# Altium schematic sheet Safety_2019_V_3_0_uController.SchDoc
size A
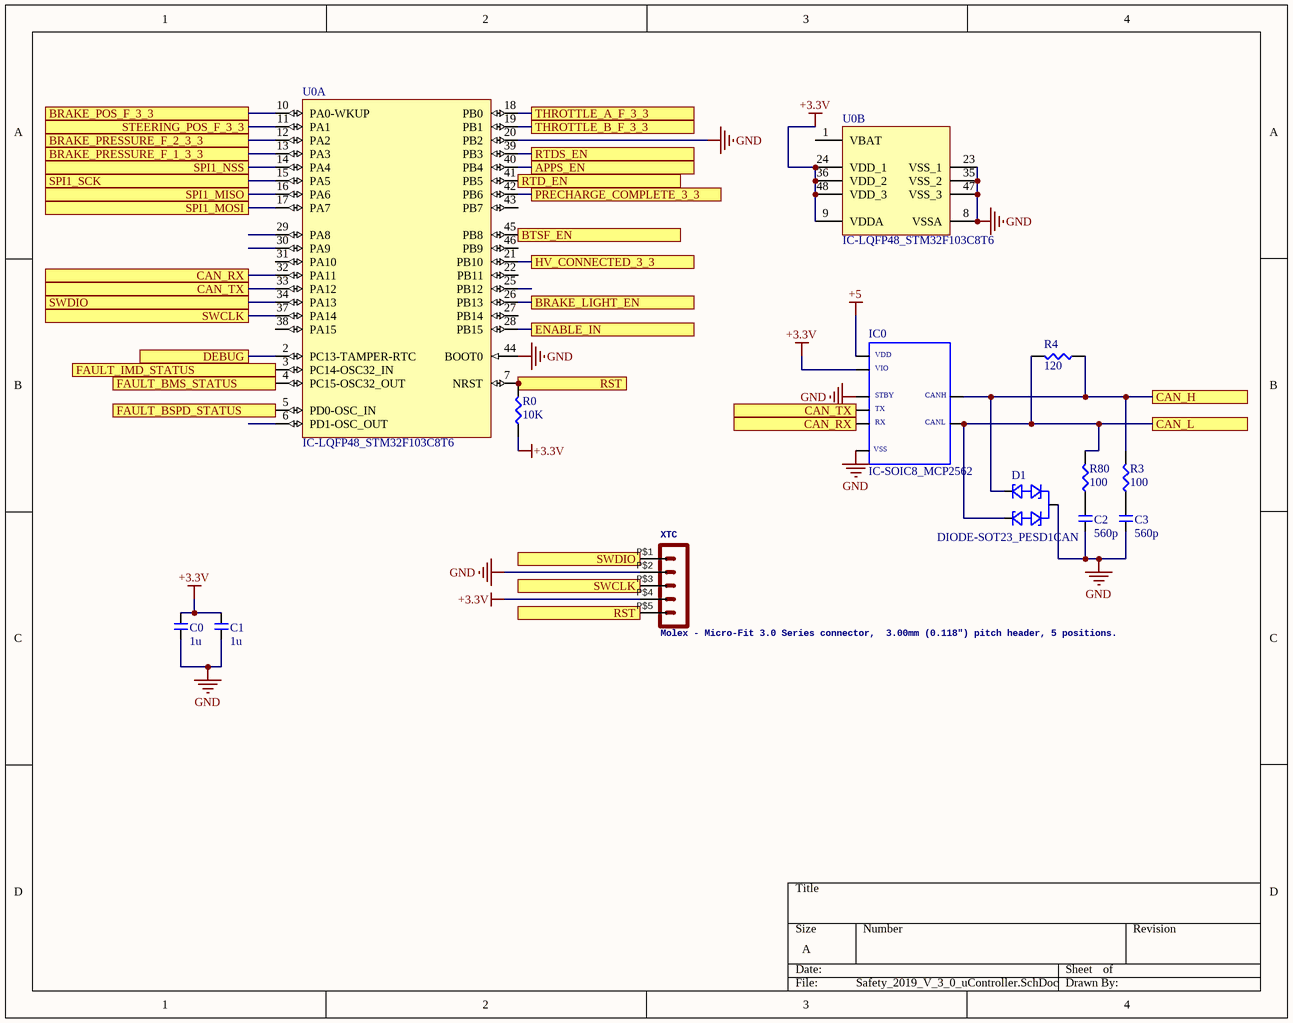
[diagram p0: Safety_2019_V_3_0_uController.SchDoc]

## Parts
C0  1u  [CAP-0603]
C1  1u  [CAP-0603]
C2  560p  [CAP-0603]
C3  560p  [CAP-0603]
D1  DIODE-SOT23_PESD1CAN  [SOT23]
IC0  IC-SOIC8_MCP2562  [SOIC8]
R0  10K  [RES-0603]
R3  100  [RES-0603]
R4  120  [RES-0603]
R80  100  [RES-0603]
U0  IC-LQFP48_STM32F103C8T6  [STM-LQFP48_M]  (parts A,B of 2)
XTC  Molex - Micro-Fit 3.0 Series connector,  3.00mm (0.118") pitch header, 5 positions.  [POS5_254MM_MALE]

## Ports
APPS_EN, BRAKE_LIGHT_EN, BRAKE_POS_F_3_3, BRAKE_PRESSURE_F_1_3_3, BRAKE_PRESSURE_F_2_3_3, BTSF_EN, CAN_H, CAN_L, CAN_RX, CAN_TX, DEBUG, ENABLE_IN, FAULT_BMS_STATUS, FAULT_BSPD_STATUS, FAULT_IMD_STATUS, HV_CONNECTED_3_3, PRECHARGE_COMPLETE_3_3, RST, RTD_EN, RTDS_EN, SPI1_MISO, SPI1_MOSI, SPI1_NSS, SPI1_SCK, STEERING_POS_F_3_3, SWCLK, SWDIO, THROTTLE_A_F_3_3, THROTTLE_B_F_3_3

## Nets
+3.3V: C0.2 C1.2 IC0.5 R0.1 U0.9(VDDA) U0.24(VDD_1) U0.36(VDD_2) U0.48(VDD_3) XTC.P$4
+5: IC0.3
GND: C0.1 C1.1 C2.1 C3.1 D1.3(G) IC0.2 IC0.8 U0.8(VSSA) U0.20(PB2) U0.23(VSS_1) U0.35(VSS_2) U0.44(BOOT0) U0.47(VSS_3) XTC.P$2
APPS_EN: U0.40(PB4) ; port APPS_EN
BRAKE_LIGHT_EN: U0.26(PB13) ; port BRAKE_LIGHT_EN
BRAKE_POS_F_3_3: U0.10(PA0-WKUP) ; port BRAKE_POS_F_3_3
BRAKE_PRESSURE_F_1_3_3: U0.13(PA3) ; port BRAKE_PRESSURE_F_1_3_3
BRAKE_PRESSURE_F_2_3_3: U0.12(PA2) ; port BRAKE_PRESSURE_F_2_3_3
BTSF_EN: U0.45(PB8) ; port BTSF_EN
CAN_H: D1.1(CAN1) IC0.7 R3.2 R4.1 ; port CAN_H
CAN_L: D1.2(CAN2) IC0.6 R4.2 R80.2 ; port CAN_L
CAN_RX: IC0.4 U0.32(PA11) ; port CAN_RX
CAN_TX: IC0.1 U0.33(PA12) ; port CAN_TX
DEBUG: U0.2(PC13-TAMPER-RTC) ; port DEBUG
ENABLE_IN: U0.28(PB15) ; port ENABLE_IN
FAULT_BMS_STATUS: U0.4(PC15-OSC32_OUT) ; port FAULT_BMS_STATUS
FAULT_BSPD_STATUS: U0.5(PD0-OSC_IN) ; port FAULT_BSPD_STATUS
FAULT_IMD_STATUS: U0.3(PC14-OSC32_IN) ; port FAULT_IMD_STATUS
HV_CONNECTED_3_3: U0.21(PB10) ; port HV_CONNECTED_3_3
PRECHARGE_COMPLETE_3_3: U0.42(PB6) ; port PRECHARGE_COMPLETE_3_3
RST: R0.2 U0.7(NRST) XTC.P$5 ; port RST
RTD_EN: U0.41(PB5) ; port RTD_EN
RTDS_EN: U0.39(PB3) ; port RTDS_EN
SPI1_MISO: U0.16(PA6) ; port SPI1_MISO
SPI1_MOSI: U0.17(PA7) ; port SPI1_MOSI
SPI1_NSS: U0.14(PA4) ; port SPI1_NSS
SPI1_SCK: U0.15(PA5) ; port SPI1_SCK
STEERING_POS_F_3_3: U0.11(PA1) ; port STEERING_POS_F_3_3
SWCLK: U0.37(PA14) XTC.P$3 ; port SWCLK
SWDIO: U0.34(PA13) XTC.P$1 ; port SWDIO
THROTTLE_A_F_3_3: U0.18(PB0) ; port THROTTLE_A_F_3_3
THROTTLE_B_F_3_3: U0.19(PB1) ; port THROTTLE_B_F_3_3
NetC2_2: C2.2 R80.1
NetC3_2: C3.2 R3.1

Not connected (* = marked no-connect by the designer): U0 1(VBAT) 6(PD1-OSC_OUT) 22(PB11) 25(PB12) 27(PB14) 29(PA8) 30(PA9) 31(PA10) 38(PA15) 43(PB7) 46(PB9)

## Notes on the sheet
- (in symbol IC-SOIC8_MCP2562) VDD; VIO; STBY; CANH; TX; RX; CANL; VSS

## Library data of the parts
C0-C3 = CAP-0603
R0 R3 R4 R80 = RES-0603
U0 = IC-LQFP48_STM32F103C8T6: A/D Converter: 2x12-bit (10 Channel); Core: ARM Cortex-M3; FLASH Size (Prog) (kB): 64; I/Os (High Current): 37; Internal RAM Size (kB): 20; Operating Frequency(F) (Processor speed) (MHz): 72; Packing: Tray; Supply Voltage(Vcc) min (V): 2; DatasheetVersion: Rev. 16; PackageVersion: Rev. 6, 06/2013; PackageReference: LQFP48; PackageDescription: 48-Pin Low Profile Quad Flat Package, 7 x 7 mm Body, 0.5 mm Pitch; Supplier 1: Digi-Key; Supplier Part Number 1: 497-6063-ND; Supplier 2: Farnell; Supplier Part Number 2: 1447637; Supplier 3: Newark; Supplier Part Number 3: 59M2182; Supplier 4: Newark; Supplier Part Number 4: 57P1222; Supplier 5: Mouser; Supplier Part Number 5: 511-STM32F103C8T6; Mounting Technology: Surface Mount; PartNumber: STM32F103C8T6; ComponentLink1Description: Manufacturer URL; ComponentLink1URL: http://www.st.com/web/en/home.html; ComponentLink2Description: Datasheet; ComponentLink2URL: http://www.st.com/st-web-ui/static/active/en/resource/technical/document/datasheet/CD00161566.pdf; ComponentLink3Description: Package Specification; ComponentLink3URL: http://www.st.com/st-web-ui/static/active/en/resource/technical/document/datasheet/DM00058181.pdf
XTC = POS5_254MM_MALE: GateName_1: G$1; SymbolName_1: HEADER_POS5; DeviceName: 43650-0524; DeviceSetName: HEADER_POS5_?; LibraryName: MOLEX Micro-Fit; Package: 43650-0524